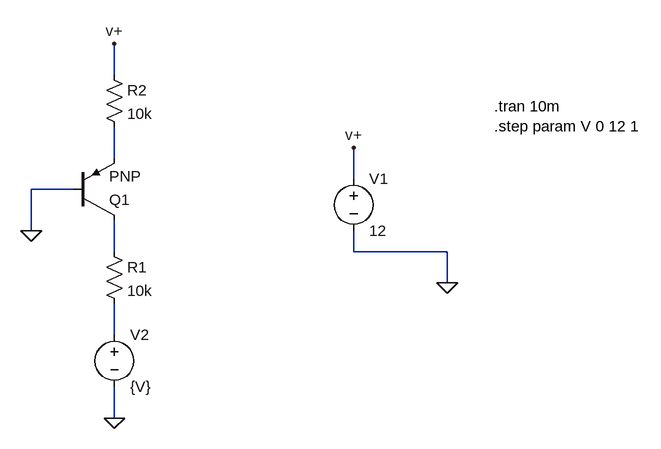
[diagram p0: schematic Draft12.asc]
Draft12.asc, the LTspice schematic file:
Version 4
SHEET 1 1032 680
WIRE 112 128 112 80
WIRE 112 256 112 208
WIRE 480 288 480 240
WIRE 48 304 -16 304
WIRE -16 368 -16 304
WIRE 112 400 112 352
WIRE 480 400 480 368
WIRE 624 400 480 400
WIRE 624 448 624 400
WIRE 112 528 112 480
WIRE 112 656 112 608
FLAG -16 368 0
FLAG 624 448 0
FLAG 480 240 v+
FLAG 112 80 v+
FLAG 112 656 0
SYMBOL pnp 48 352 M180
SYMATTR InstName Q1
SYMBOL res 96 384 R0
SYMATTR InstName R1
SYMATTR Value 10k
SYMBOL res 96 112 R0
SYMATTR InstName R2
SYMATTR Value 10k
SYMBOL voltage 480 272 R0
SYMATTR InstName V1
SYMATTR Value 12
SYMBOL voltage 112 512 R0
SYMATTR InstName V2
SYMATTR Value {V}
TEXT 696 176 Left 2 !.tran 10m\n.step param V 0 12 1

The netlist it stands for:
* Draft12.asc
Q1 N002 0 N001 0 PNP
R1 N002 N003 10k
R2 v+ N001 10k
V1 v+ 0 12
V2 N003 0 {V}
.model NPN NPN
.model PNP PNP
.lib standard.bjt
.tran 10m
.step param V 0 12 1
.backanno
.end